# Altium schematic sheet Block Diagram.SchDoc
size Tabloid; DrawnBy: Krutav Shah; SheetNumber: 3; SheetTotal: 3
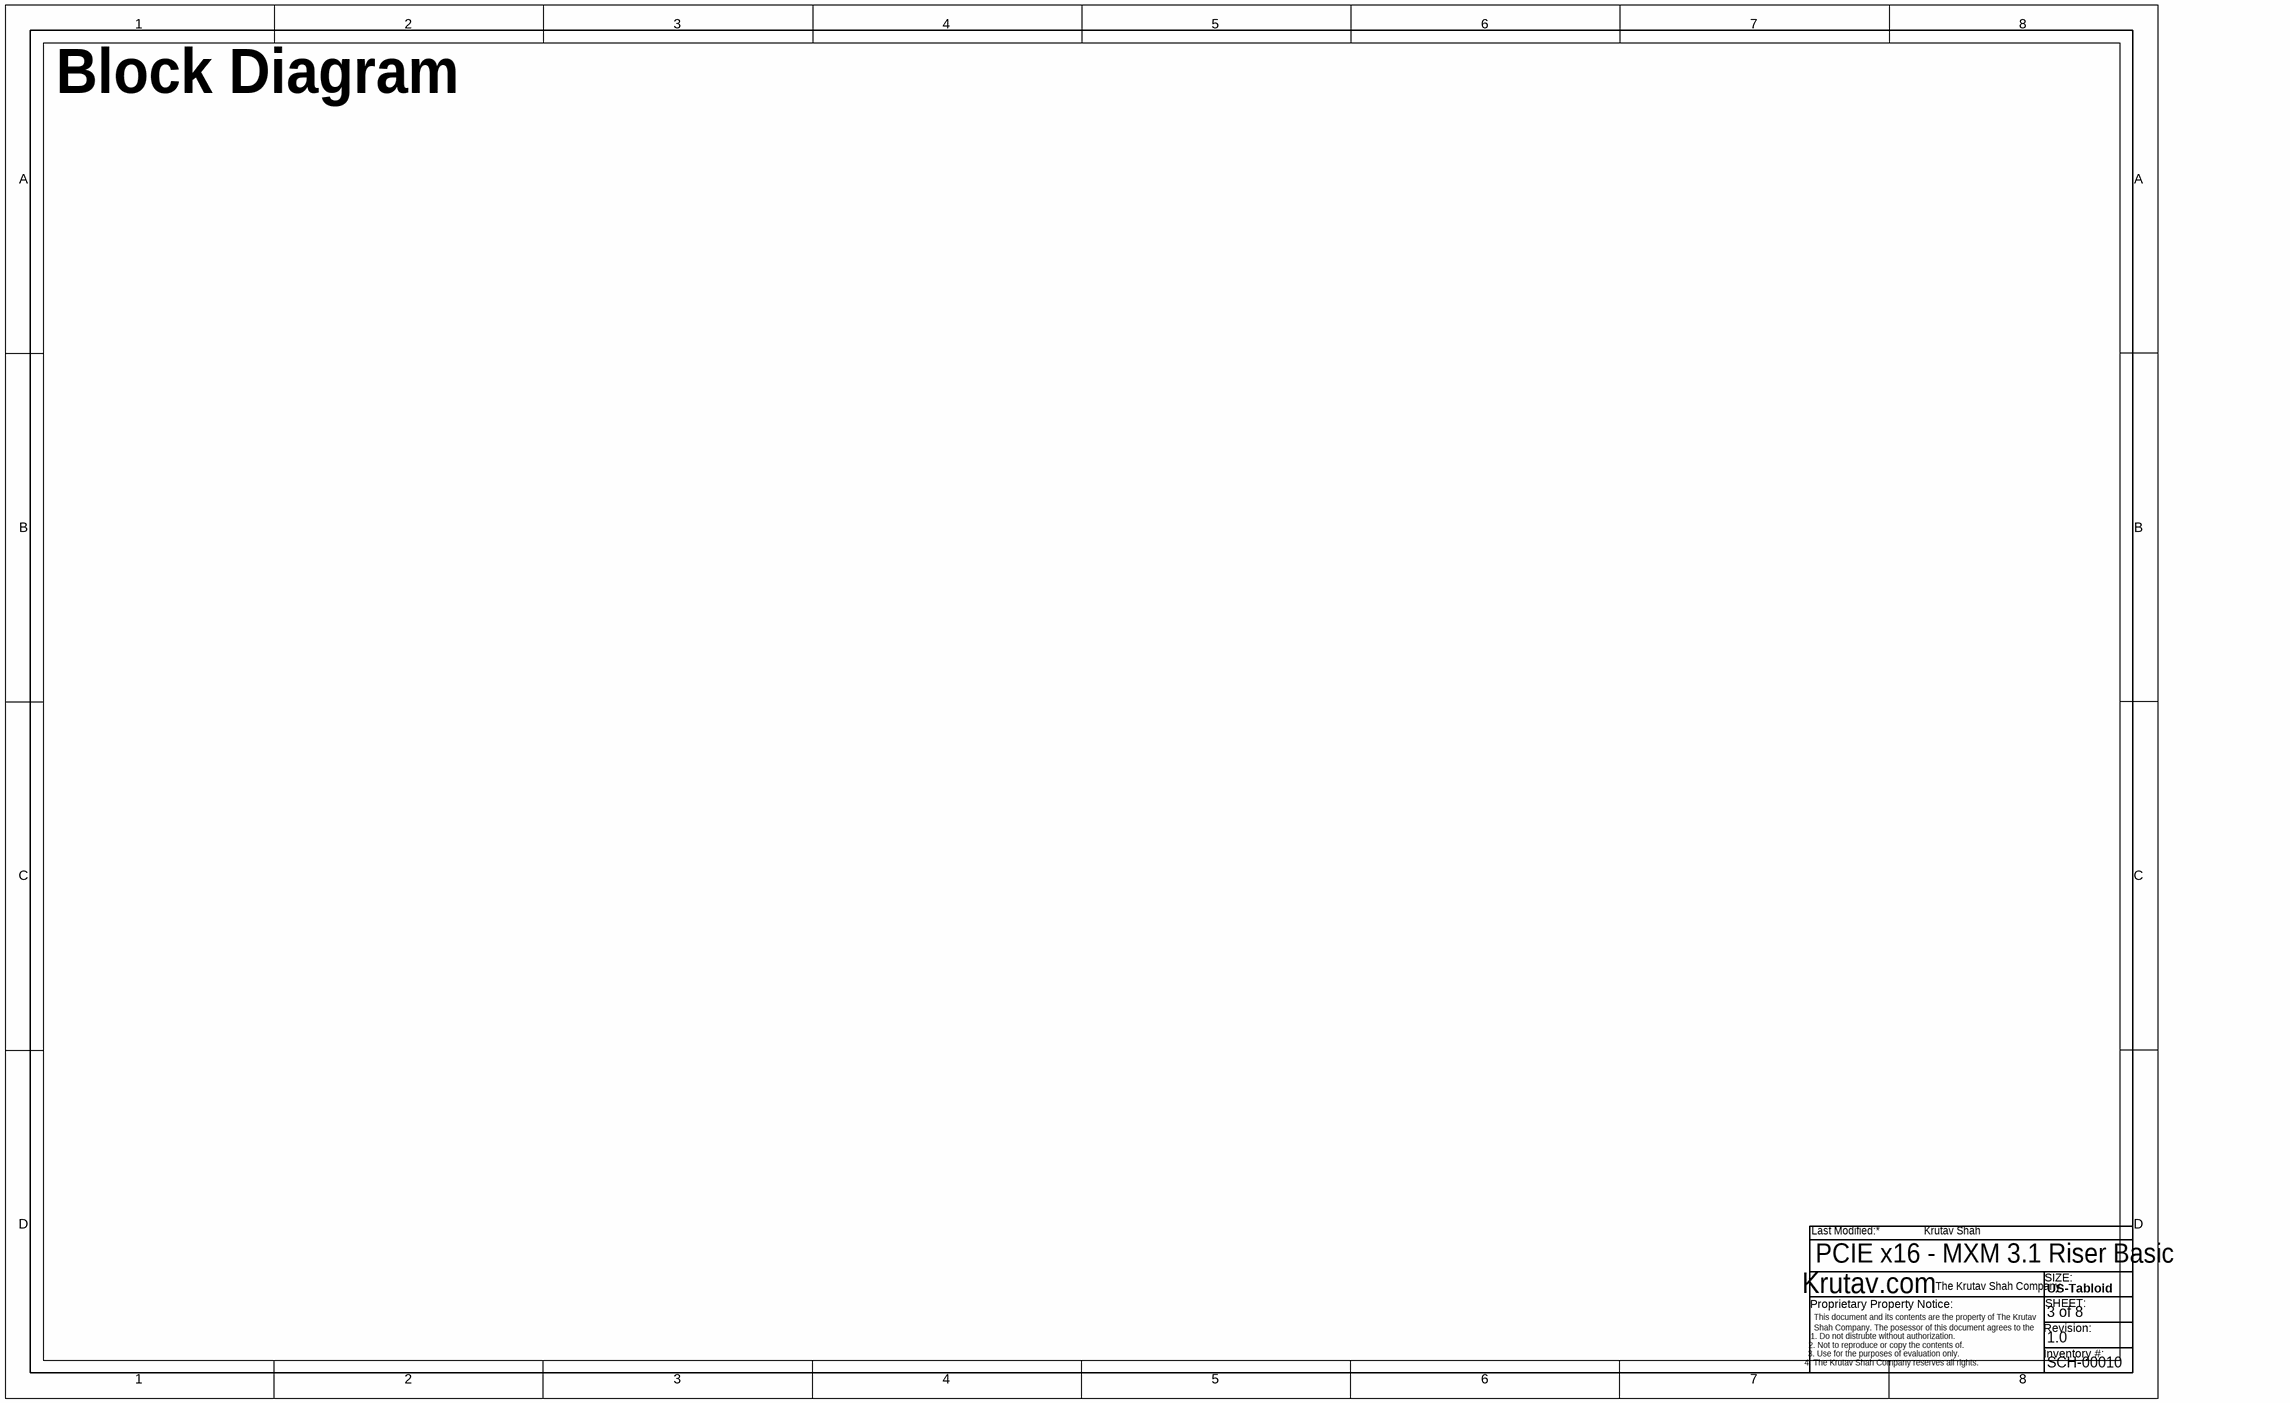
[diagram p0: Block Diagram.SchDoc]

## Notes on the sheet
- Block Diagram
- PCIE x16 - MXM 3.1 Riser Basic
- 3 of 8
- 1.0
- SCH-00010
- Last Modified:
- Krutav.com
- The Krutav Shah Company
- US-Tabloid
- SIZE:
- SHEET:
- This document and its contents are the property of The Krutav Shah Company. The posessor of this document agrees to the following:
- Proprietary Property Notice:
- 1. Do not distrubte without authorization.
- 3. Use for the purposes of evaluation only.
- 2. Not to reproduce or copy the contents of.
- 4. The Krutav Shah Company reserves all rights.
- Revision:
- Inventory #: